# EAGLE design PCB-ENCODER (EAGLE 6.4)
SKAARHOJ 2012 Rotary Encoder Breakout Board
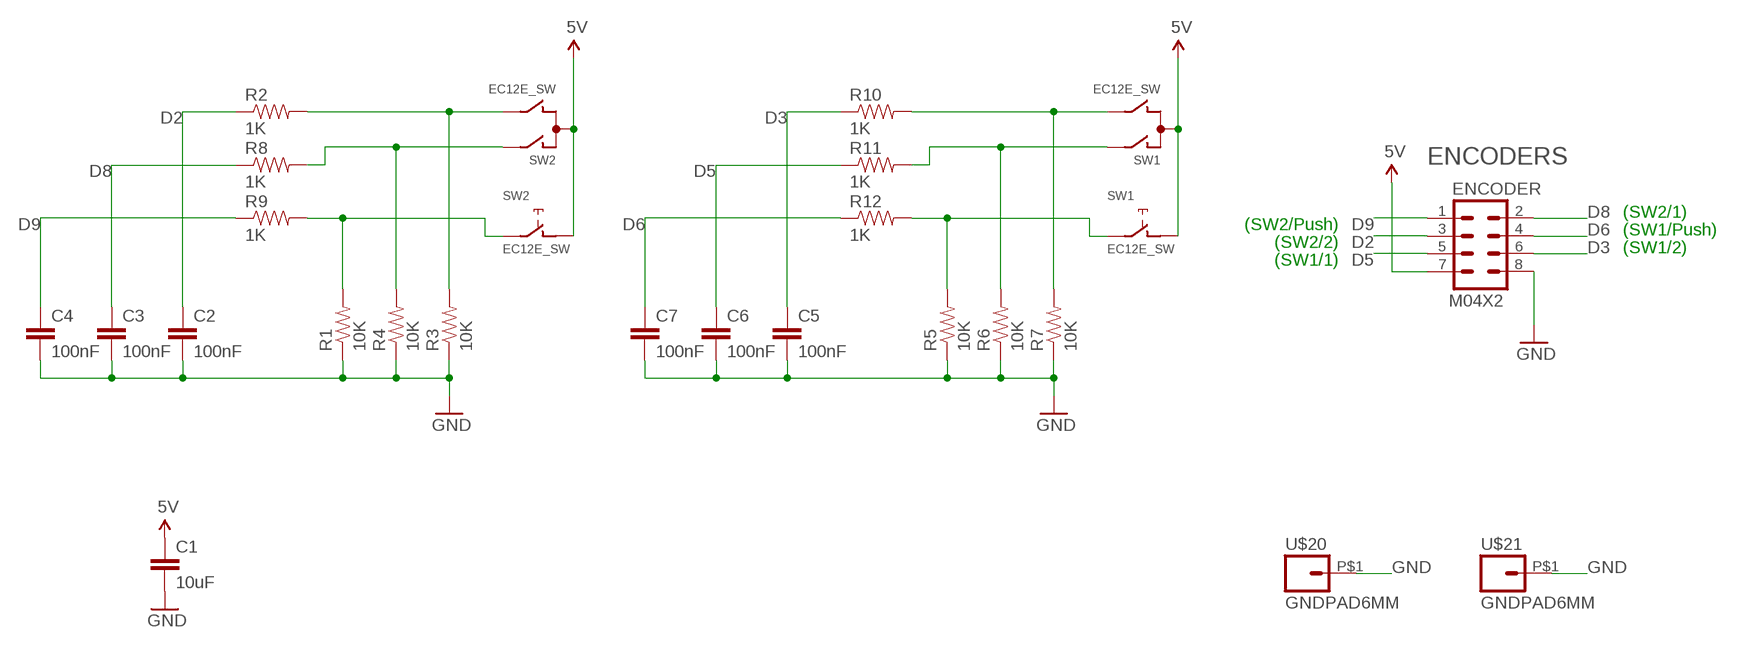
[diagram p0: schematic, sheet 1]

## Parts
C1  10uF  CAP0603-CAP  [0603-CAP]
C2  100nF  CAP0603-CAP  [0603-CAP]
C3  100nF  CAP0603-CAP  [0603-CAP]
C4  100nF  CAP0603-CAP  [0603-CAP]
C5  100nF  CAP0603-CAP  [0603-CAP]
C6  100nF  CAP0603-CAP  [0603-CAP]
C7  100nF  CAP0603-CAP  [0603-CAP]
ENCODER  M04X2  [2X4]
R1  10K  RESISTOR0603-RES  [0603-RES]
R2  1K  RESISTOR0603-RES  [0603-RES]
R3  10K  RESISTOR0603-RES  [0603-RES]
R4  10K  RESISTOR0603-RES  [0603-RES]
R5  10K  RESISTOR0603-RES  [0603-RES]
R6  10K  RESISTOR0603-RES  [0603-RES]
R7  10K  RESISTOR0603-RES  [0603-RES]
R8  1K  RESISTOR0603-RES  [0603-RES]
R9  1K  RESISTOR0603-RES  [0603-RES]
R10  1K  RESISTOR0603-RES  [0603-RES]
R11  1K  RESISTOR0603-RES  [0603-RES]
R12  1K  RESISTOR0603-RES  [0603-RES]
SW1  EC12E_SW  [ALPS_EC12E_SW]
SW2  EC12E_SW  [ALPS_EC12E_SW]
U$20  GNDPAD6MM  [3.2MMPAD6MM]
U$21  GNDPAD6MM  [3.2MMPAD6MM]

## Nets
5V [Power]: C1.1 ENCODER.7 SW1.C SW1.D SW2.C SW2.D
D2: C2.1 ENCODER.3 R2.1
D3: C5.1 ENCODER.6 R10.1
D5: C6.1 ENCODER.5 R11.1
D6: C7.1 ENCODER.4 R12.1
D8: C3.1 ENCODER.2 R8.1
D9: C4.1 ENCODER.1 R9.1
GND [Power]: C1.2 C2.2 C3.2 C4.2 C5.2 C6.2 C7.2 ENCODER.8 R1.1 R3.1 R4.1 R5.1 R6.1 R7.1 U$20.P$1 U$21.P$1
N$1: R2.2 R3.2 SW2.B
N$2: R7.2 R10.2 SW1.B
N$3: R6.2 R11.2 SW1.A
N$4: R4.2 R8.2 SW2.A
N$5: R1.2 R9.2 SW2.E
N$6: R5.2 R12.2 SW1.E
Unconnected: SW1.GND1(G) SW1.GND2(G) SW2.GND1(G) SW2.GND2(G)

## Notes on the sheet
- ENCODERS
- (SW2/Push) | (SW2/1)
- (SW2/2) | (SW1/Push)
- (SW1/1) | (SW1/2)

## Library data of the parts
C1-C7 = SparkFun:CAP: Capacitor Standard 0603 ceramic capacitor, and 0.1" leaded capacitor.
ENCODER = SparkFun:M04X2
R1-R12 = SparkFun:RESISTOR: Resistor Basic schematic elements and footprints for 0603, 1206, and PTH resistors.
SW1 SW2 = switch-alps:EC12E_SW: ALPS rotary Encoder EC12E series with switch; MPN: EC12E2424407; OC_FARNELL: 1520813; OC_NEWARK: 74M1068
U$20 U$21 = SKAARHOJ:GNDPAD

## Net classes
0 default: width 0.203 mm, drill 0.406 mm, clearance 0.203 mm
1 Power: width 0.406 mm, drill 0.61 mm, clearance 0.305 mm

## Board
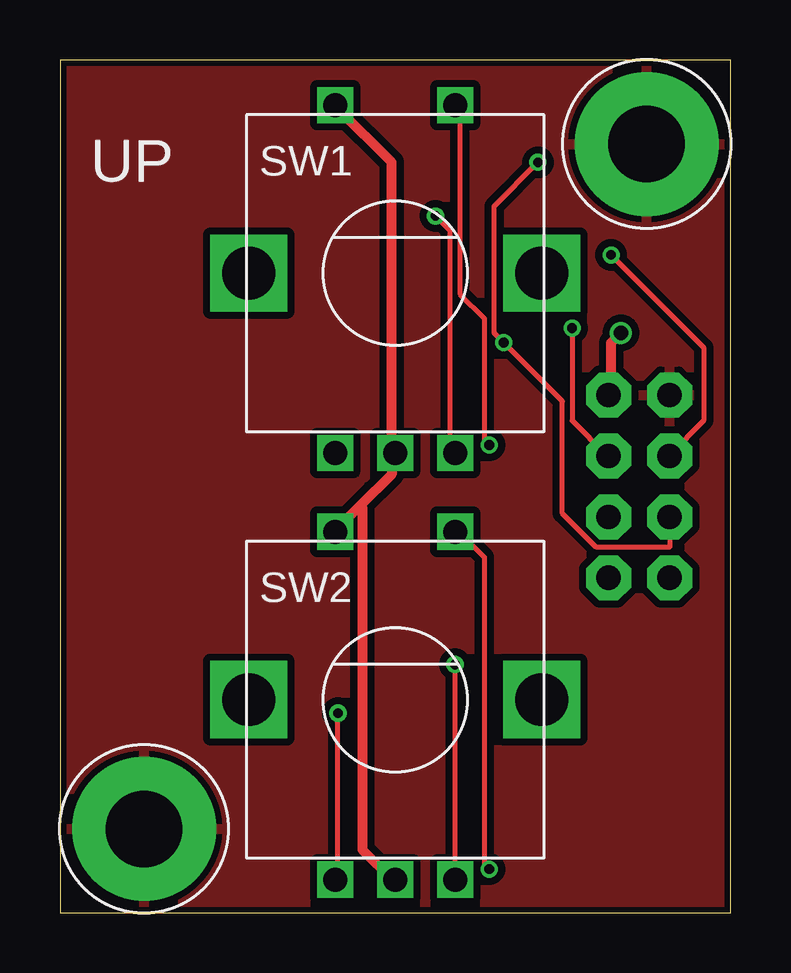
[diagram p1: board, top side]
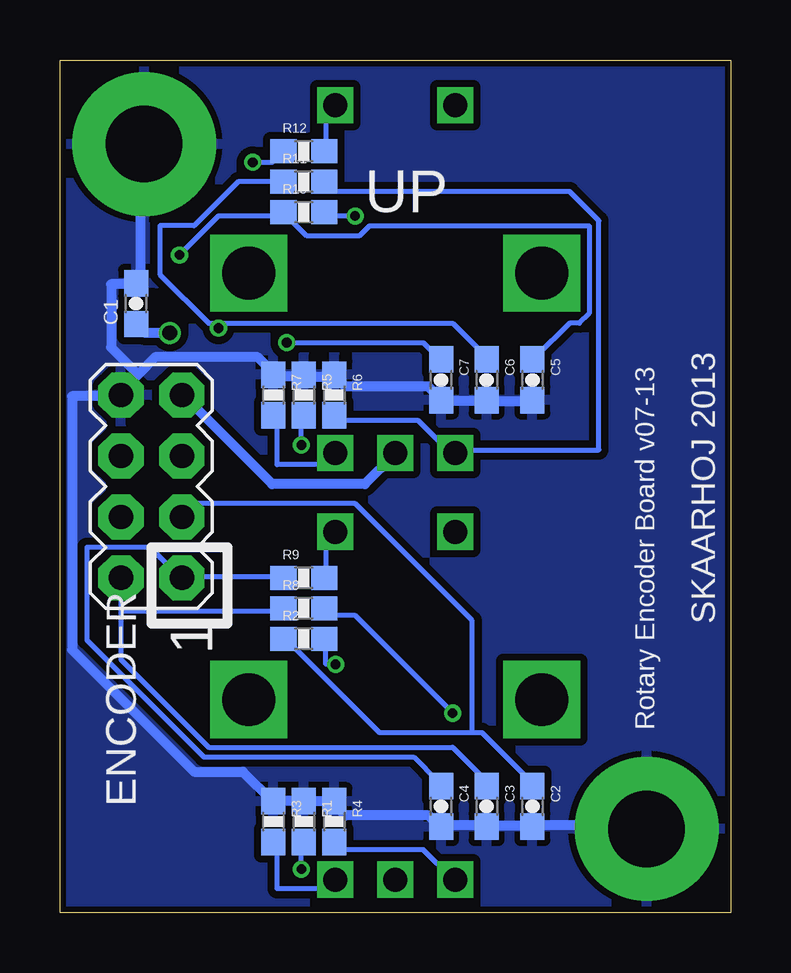
[diagram p2: board, bottom side, seen from below]

Size 27.94 x 35.56 mm. Coordinates in mm from the lower left corner, seen from the top.
Outline: 0,0 27.94,0 27.94,35.56 0,35.56 0,0
Copper layers (1*16): Top 0.035mm / dielectric 1.5mm / Bottom 0.035mm
Design rules "Fusion_eagle_rule_v1.1": minimum track width 6mil, minimum drill 12mil, track to track 6mil, track to pad 6mil, pad to pad 6mil, via to via 6mil, smd to smd 0mil, copper to edge 10mil, drill to drill 10mil, minimum pad ring 10mil, minimum via ring 6mil, stop-mask expansion 2mil, vias tented up to drill 100mil, thermal gap 10mil

### Footprints (pad centres in the part's own frame; a part is rotated, then mirrored left to right if it is on the bottom)
0603-CAP = smd 1.1 x 1: 1 -0.85,0; 2 0.85,0
2X4 = drill 1.016 pad 1.88 octagon: 1 -3.81,-1.27; 2 -3.81,1.27; 3 -1.27,-1.27; 4 -1.27,1.27; 5 1.27,-1.27; 6 1.27,1.27; 7 3.81,-1.27; 8 3.81,1.27
0603-RES = smd 1.1 x 1: 1 -0.85,0; 2 0.85,0
ALPS_EC12E_SW = drill 1 square: A -2.5,-7.5; B 2.5,-7.5; C 0,-7.5; D -2.5,7; E 2.5,7 | drill 2.2 square: GND1 -6.1,0; GND2 6.1,0
3.2MMPAD6MM = drill 3.2 pad 6: P$1 0,0

### Placement (x,y rotation side)
C1  24.77,25.4 90 bottom
C2  8.26,4.45 270 bottom
C3  10.16,4.45 270 bottom
C4  12.06,4.45 270 bottom
C5  8.26,22.23 270 bottom
C6  10.16,22.23 270 bottom
C7  12.06,22.23 270 bottom
ENCODER  24.13,17.78 90 bottom
R1  17.78,3.81 270 bottom
R2  17.78,11.43 0 bottom
R3  19.05,3.81 270 bottom
R4  16.51,3.81 270 bottom
R5  17.78,21.59 270 bottom
R6  16.51,21.59 270 bottom
R7  19.05,21.59 270 bottom
R8  17.78,12.7 0 bottom
R9  17.78,13.97 0 bottom
R10  17.78,29.21 0 bottom
R11  17.78,30.48 0 bottom
R12  17.78,31.75 0 bottom
SW1  13.97,26.67 0 top
SW2  13.97,8.89 0 top
U$20  3.5,3.5 0 top
U$21  24.44,32.06 0 top

### Tracks (layer width: path | path; a pad name or v marks a point on that pad's centre or on a via)
5V  (via drill 0.61)
  Top 0.406: v23.37,24.18 22.96,23.77 22.96,21.74 ENCODER.7 | 12.5,16.97 13.82,18.29 13.82,19.1 SW1.C 13.82,19.3 13.82,31.29 11.58,33.53 SW1.D | 12.5,16.97 11.58,16.05 SW2.D | SW2.C 13.82,1.42 12.6,2.64 12.6,16.87 12.5,16.97
  Bottom 0.406: v23.37,24.18 24.38,24.18 24.59,24.38 C1.1 | ENCODER.7 22.76,21.54 19.1,17.88 15.24,17.88 14.02,19.1 SW1.C
D2
  Bottom 0.203: 10.77,7.52 14.63,7.52 18.49,11.38 R2.1 | 10.77,7.52 10.36,7.52 8.33,5.49 C2.1 | 10.77,7.52 10.77,12.19 15.65,17.07 22.35,17.07 22.76,16.66 ENCODER.3
D3  (via drill 0.41)
  Top 0.203: v22.96,27.43 26.82,23.57 26.82,20.52 25.4,19.1 ENCODER.6
  Bottom 0.203: C5.1 8.13,23.16 6.71,24.59 6.3,24.59 5.89,24.99 5.89,28.65 15.04,28.65 15.44,28.25 17.68,28.25 18.49,29.06 R10.1 18.69,29.06 21.34,29.06 v22.96,27.43
D5  (via drill 0.41)
  Top 0.203: v21.34,24.38 21.34,20.52 22.76,19.1 ENCODER.5
  Bottom 0.203: 21.34,24.59 21.74,24.59 23.77,26.62 23.77,28.65 22.35,28.65 20.52,30.48 R11.1 | 21.34,24.59 11.58,24.59 10.16,23.16 C6.1 | 21.34,24.59 v21.34,24.38
D6  (via drill 0.41)
  Top 0.203: ENCODER.4 25.4,15.24 22.35,15.24 20.93,16.66 20.93,21.34 v18.49,23.77 18.09,24.18 18.09,29.46 v19.91,31.29
  Bottom 0.203: v18.49,23.77 12.8,23.77 12.19,23.16 C7.1 | v19.91,31.29 19.1,31.29 18.69,31.7 R12.1
D8
  Bottom 0.203: ENCODER.2 25.4,12.6 | 25.4,12.6 25.4,10.57 21.74,6.91 11.58,6.91 10.16,5.49 C3.1 | 25.4,12.6 18.69,12.6 R8.1
D9
  Bottom 0.203: C4.1 12.19,5.49 13.21,6.5 21.95,6.5 26.82,11.38 26.82,15.24 24.18,15.24 22.96,14.02 ENCODER.1 22.76,14.02 18.69,14.02 R9.1
GND
  Bottom 0.406: 10.16,3.66 8.33,3.66 C2.2 8.13,3.66 3.66,3.66 U$20.P$1 | 10.16,3.66 11.99,3.66 C4.2 12.19,3.66 12.6,4.06 16.05,4.06 16.46,4.47 R4.1 16.66,4.67 17.68,4.67 R1.1 17.88,4.67 18.9,4.67 R3.1 19.1,4.67 20.32,5.89 22.35,5.89 27.43,10.97 27.43,21.54 25.4,21.54 ENCODER.8 25.4,21.74 24.69,22.45 | 10.16,3.66 C3.2 | 10.16,21.34 8.33,21.34 C5.2 | 10.16,21.34 11.99,21.34 C7.2 12.19,21.54 12.6,21.95 16.05,21.95 16.46,22.35 R6.1 16.66,22.35 17.68,22.35 R5.1 17.88,22.35 18.9,22.35 R7.1 19.1,22.55 19.71,23.16 23.98,23.16 24.69,22.45 | 10.16,21.34 C6.2 | U$21.P$1 24.59,31.9 24.59,26.42 C1.2 24.79,26.21 25.81,26.21 25.81,23.57 24.69,22.45
  pour Top: 0,0 27.94,0 27.94,35.56 0,35.56
  pour Bottom: 0,0 27.94,0 27.94,35.56 0,35.56
N$1  (via drill 0.41)
  Top 0.203: v16.46,10.36 16.46,1.42 SW2.B
  Bottom 0.203: R3.2 18.9,2.85 18.9,1.02 16.87,1.02 16.66,1.22 SW2.B | v16.46,10.36 16.87,10.36 16.87,11.38 R2.2
N$2  (via drill 0.41)
  Top 0.203: v15.65,29.06 16.26,28.45 16.26,19.51 16.46,19.3 SW1.B
  Bottom 0.203: R7.2 18.9,20.73 18.9,18.69 17.07,18.69 16.66,19.1 SW1.B | v15.65,29.06 16.87,29.06 R10.2
N$3
  Bottom 0.203: R6.2 16.46,20.73 16.26,20.52 13.01,20.52 11.79,19.3 11.58,19.3 SW1.A 11.38,19.3 5.49,19.3 5.49,28.85 6.71,30.07 16.46,30.07 16.87,30.48 R11.2
N$4  (via drill 0.41)
  Top 0.203: v11.58,8.33 11.58,1.42 SW2.A
  Bottom 0.203: R4.2 16.46,2.85 16.26,2.64 12.8,2.64 11.58,1.42 SW2.A | v11.58,8.33 15.65,12.39 16.66,12.39 16.87,12.6 R8.2
N$5  (via drill 0.41)
  Top 0.203: v17.88,1.83 17.68,2.03 17.68,14.83 16.66,15.85 SW2.E
  Bottom 0.203: v17.88,1.83 17.88,2.85 R1.2 | R9.2 16.87,14.02 16.87,15.85 16.66,15.85 SW2.E
N$6  (via drill 0.41)
  Top 0.203: v17.88,19.51 17.68,19.71 17.68,24.79 16.66,25.81 16.66,33.53 SW1.E
  Bottom 0.203: v17.88,19.51 17.88,20.73 R5.2 | R12.2 16.87,31.9 16.87,33.53 16.66,33.53 SW1.E

### Text on the board
_tsilk: UP
_bsilk: UP | SKAARHOJ 2013 | 1 | Rotary Encoder Board v07-13